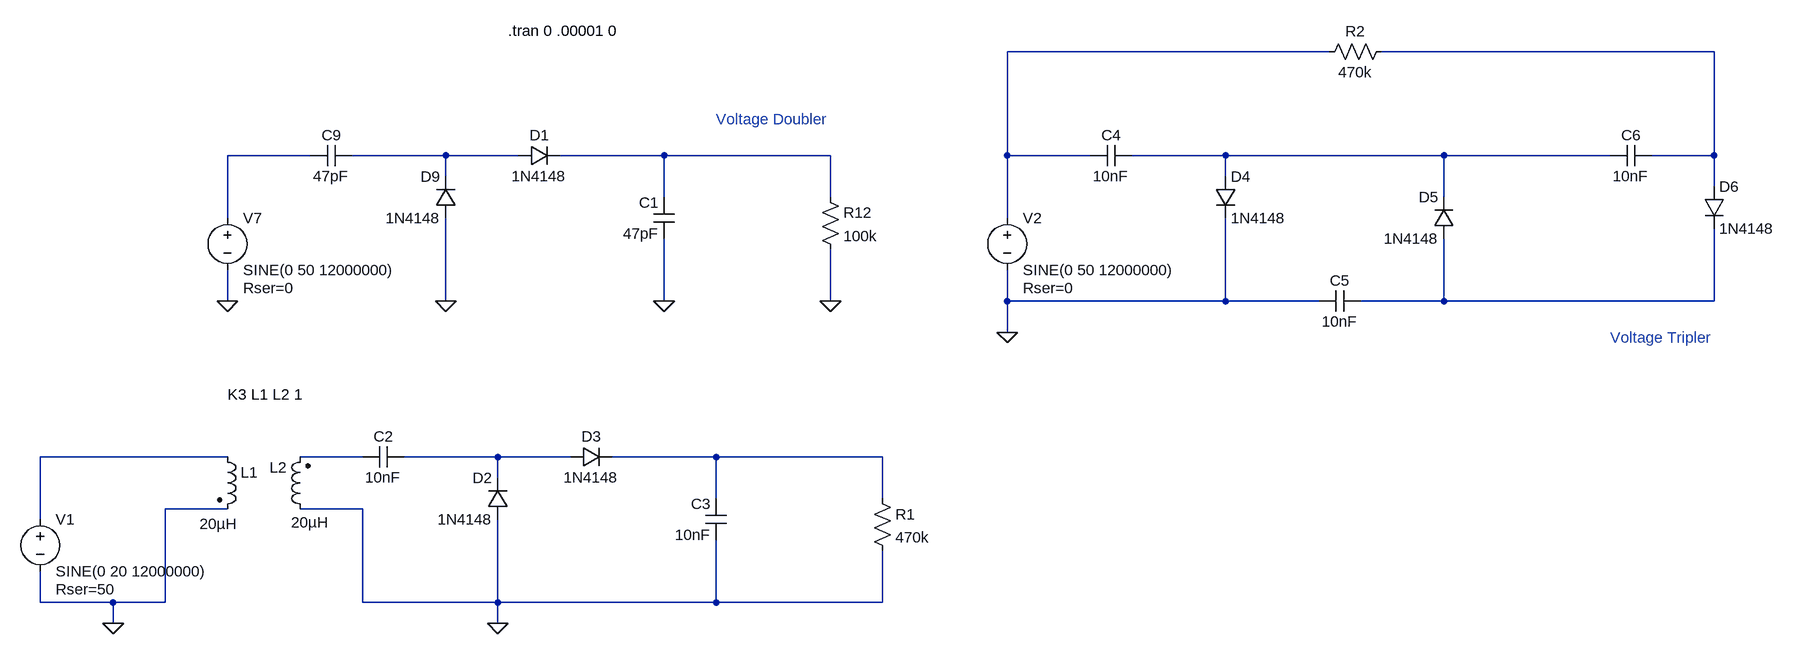
[diagram p0: schematic Doubler.asc]
Doubler.asc, the LTspice schematic file:
Version 4
SHEET 1 1732 1460
WIRE 48 560 -448 560
WIRE 640 560 128 560
WIRE -1520 720 -1648 720
WIRE -1312 720 -1456 720
WIRE -1200 720 -1312 720
WIRE -976 720 -1136 720
WIRE -720 720 -976 720
WIRE -448 720 -448 560
WIRE -320 720 -448 720
WIRE -112 720 -256 720
WIRE 224 720 -112 720
WIRE 480 720 224 720
WIRE 640 720 640 560
WIRE 640 720 544 720
WIRE -1312 752 -1312 720
WIRE -112 752 -112 720
WIRE 640 768 640 720
WIRE -976 784 -976 720
WIRE -720 784 -720 720
WIRE 224 784 224 720
WIRE -1648 816 -1648 720
WIRE -448 816 -448 720
WIRE -1648 944 -1648 896
WIRE -1312 944 -1312 816
WIRE -976 944 -976 848
WIRE -720 944 -720 864
WIRE -448 944 -448 896
WIRE -112 944 -112 816
WIRE -112 944 -448 944
WIRE 32 944 -112 944
WIRE 224 944 224 848
WIRE 224 944 96 944
WIRE 640 944 640 832
WIRE 640 944 224 944
WIRE -448 992 -448 944
WIRE -1648 1184 -1936 1184
WIRE -1440 1184 -1536 1184
WIRE -1232 1184 -1376 1184
WIRE -1120 1184 -1232 1184
WIRE -896 1184 -1056 1184
WIRE -640 1184 -896 1184
WIRE -1232 1216 -1232 1184
WIRE -896 1248 -896 1184
WIRE -640 1248 -640 1184
WIRE -1648 1264 -1744 1264
WIRE -1440 1264 -1536 1264
WIRE -1936 1280 -1936 1184
WIRE -1936 1408 -1936 1360
WIRE -1824 1408 -1936 1408
WIRE -1744 1408 -1744 1264
WIRE -1744 1408 -1824 1408
WIRE -1440 1408 -1440 1264
WIRE -1232 1408 -1232 1280
WIRE -1232 1408 -1440 1408
WIRE -896 1408 -896 1312
WIRE -896 1408 -1232 1408
WIRE -640 1408 -640 1328
WIRE -640 1408 -896 1408
WIRE -1824 1440 -1824 1408
WIRE -1232 1440 -1232 1408
FLAG -1648 944 0
FLAG -720 944 0
FLAG -1312 944 0
FLAG -976 944 0
FLAG -1824 1440 0
FLAG -1232 1440 0
FLAG -448 992 0
SYMBOL voltage -1648 800 R0
WINDOW 123 0 0 Left 0
WINDOW 39 24 124 Left 2
SYMATTR SpiceLine Rser=0
SYMATTR InstName V7
SYMATTR Value SINE(0 50 12000000)
SYMBOL diode -1296 816 R180
WINDOW 0 24 64 Left 2
WINDOW 3 24 0 Left 2
SYMATTR InstName D9
SYMATTR Value 1N4148
SYMBOL cap -1456 704 R90
WINDOW 0 0 32 VBottom 2
WINDOW 3 32 32 VTop 2
SYMATTR InstName C9
SYMATTR Value 47pF
SYMBOL res -736 768 R0
SYMATTR InstName R12
SYMATTR Value 100k
SYMBOL diode -1200 736 R270
WINDOW 0 32 32 VTop 2
WINDOW 3 0 32 VBottom 2
SYMATTR InstName D1
SYMATTR Value 1N4148
SYMBOL cap -960 848 R180
WINDOW 0 24 56 Left 2
WINDOW 3 24 8 Left 2
SYMATTR InstName C1
SYMATTR Value 47pF
SYMBOL ind2 -1664 1168 R0
WINDOW 3 -27 119 Left 2
SYMATTR InstName L1
SYMATTR Value 20µH
SYMATTR Type ind
SYMBOL ind2 -1520 1280 R180
WINDOW 0 36 80 Left 2
WINDOW 3 -28 -5 Left 2
SYMATTR InstName L2
SYMATTR Value 20µH
SYMATTR Type ind
SYMBOL diode -1216 1280 R180
WINDOW 0 24 64 Left 2
WINDOW 3 24 0 Left 2
SYMATTR InstName D2
SYMATTR Value 1N4148
SYMBOL cap -1376 1168 R90
WINDOW 0 0 32 VBottom 2
WINDOW 3 32 32 VTop 2
SYMATTR InstName C2
SYMATTR Value 10nF
SYMBOL res -656 1232 R0
SYMATTR InstName R1
SYMATTR Value 470k
SYMBOL diode -1120 1200 R270
WINDOW 0 32 32 VTop 2
WINDOW 3 0 32 VBottom 2
SYMATTR InstName D3
SYMATTR Value 1N4148
SYMBOL cap -880 1312 R180
WINDOW 0 24 56 Left 2
WINDOW 3 24 8 Left 2
SYMATTR InstName C3
SYMATTR Value 10nF
SYMBOL voltage -1936 1264 R0
WINDOW 123 0 0 Left 0
WINDOW 39 24 124 Left 2
SYMATTR SpiceLine Rser=50
SYMATTR InstName V1
SYMATTR Value SINE(0 20 12000000)
SYMBOL voltage -448 800 R0
WINDOW 123 0 0 Left 0
WINDOW 39 24 124 Left 2
SYMATTR SpiceLine Rser=0
SYMATTR InstName V2
SYMATTR Value SINE(0 50 12000000)
SYMBOL diode -128 752 R0
SYMATTR InstName D4
SYMATTR Value 1N4148
SYMBOL cap -256 704 R90
WINDOW 0 0 32 VBottom 2
WINDOW 3 32 32 VTop 2
SYMATTR InstName C4
SYMATTR Value 10nF
SYMBOL res 144 544 R90
WINDOW 0 0 56 VBottom 2
WINDOW 3 32 56 VTop 2
SYMATTR InstName R2
SYMATTR Value 470k
SYMBOL diode 240 848 R180
WINDOW 0 24 64 Left 2
WINDOW 3 24 0 Left 2
SYMATTR InstName D5
SYMATTR Value 1N4148
SYMBOL cap 32 960 R270
WINDOW 0 32 32 VTop 2
WINDOW 3 0 32 VBottom 2
SYMATTR InstName C5
SYMATTR Value 10nF
SYMBOL cap 544 704 R90
WINDOW 0 0 32 VBottom 2
WINDOW 3 32 32 VTop 2
SYMATTR InstName C6
SYMATTR Value 10nF
SYMBOL diode 624 768 R0
SYMATTR InstName D6
SYMATTR Value 1N4148
TEXT -1216 528 Left 2 !.tran 0 .00001 0
TEXT -1648 1088 Left 2 !K3 L1 L2 1
TEXT 480 1000 Left 2 ;Voltage Tripler
TEXT -896 664 Left 2 ;Voltage Doubler

The netlist it stands for:
* Doubler.asc
V7 N003 0 SINE(0 50 12000000) Rser=0
D9 0 N004 1N4148
C9 N004 N003 47pF
R12 N005 0 100k
D1 N004 N005 1N4148
C1 0 N005 47pF
L1 N008 0 20µH
L2 0 N009 20µH
D2 0 N010 1N4148
C2 N010 N009 10nF
R1 N011 0 470k
D3 N010 N011 1N4148
C3 0 N011 10nF
V1 N008 0 SINE(0 20 12000000) Rser=50
V2 N001 0 SINE(0 50 12000000) Rser=0
D4 N006 0 1N4148
C4 N006 N001 10nF
R2 N002 N001 470k
D5 N007 N006 1N4148
C5 0 N007 10nF
C6 N002 N006 10nF
D6 N002 N007 1N4148
.model D D
.lib standard.dio
.tran 0 .00001 0
K3 L1 L2 1
* Voltage Tripler
* Voltage Doubler
.backanno
.end